# Altium project Pet_Feeder_Board.PrjPcb (part 1 of 3)
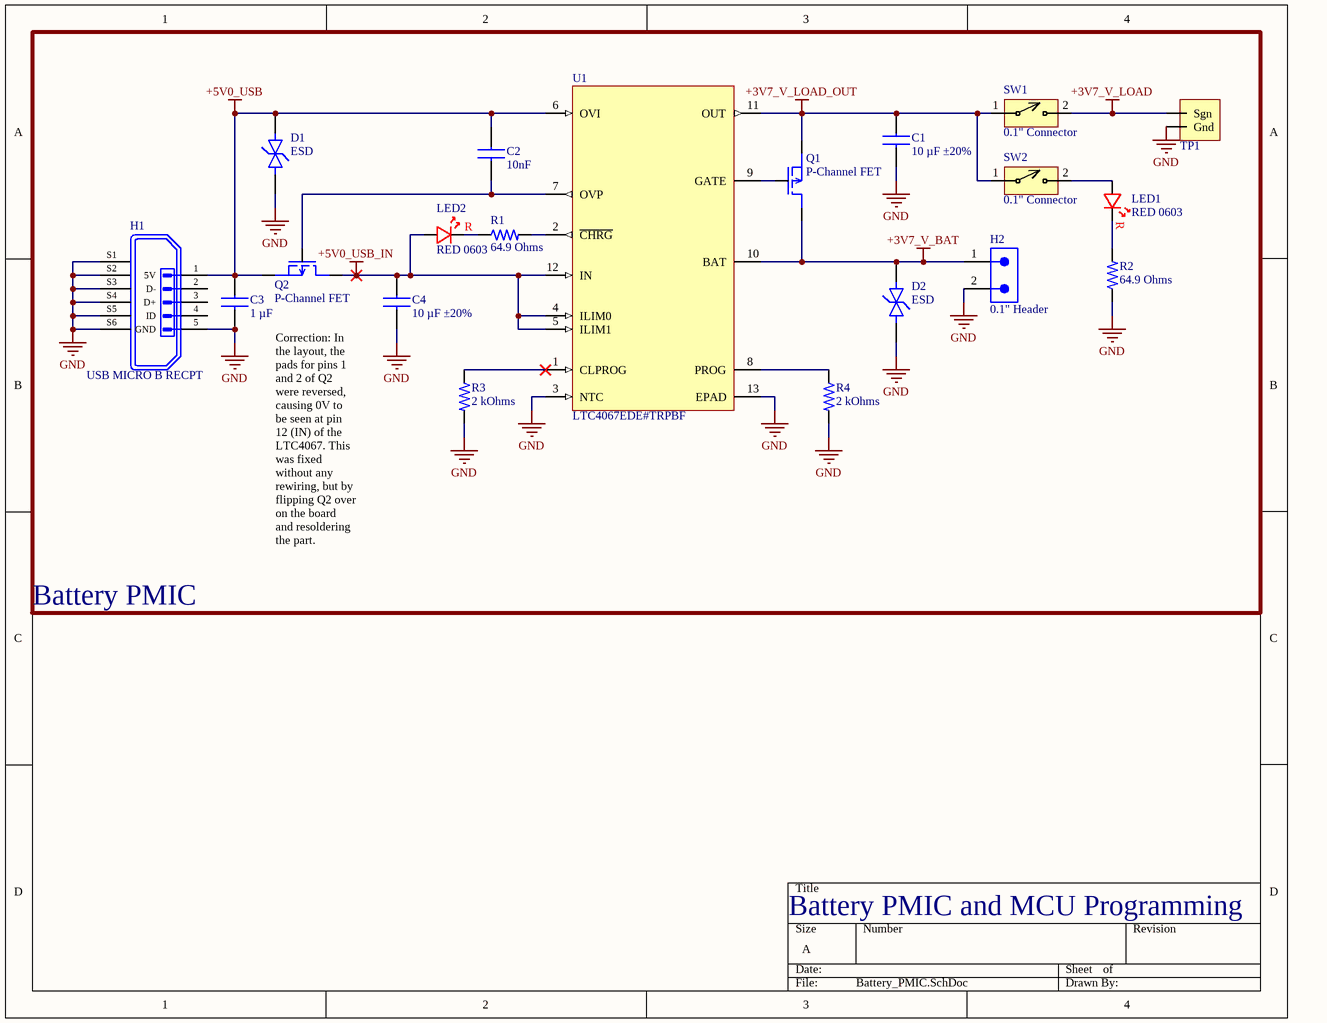
[diagram p0: Battery_PMIC.SchDoc]
6 sheets, 99 parts. Net scope: flat (ports and power ports of the same name join across sheets).
Board file: Pet_Feeder_PCB.PcbDoc
Sheets:
  Battery_PMIC.SchDoc
  Power_Circuit_Schematic.SchDoc
  BG_PWR_Radio_Schematic.SchDoc
  Peripheral_Schematic.SchDoc
  BG_IO_Programming_Schematic.SchDoc
  Notes.SchDoc

## Sheet Battery_PMIC.SchDoc
size A; SheetNumber: 1; SheetTotal: 6

### Parts
C1  10 µF ±20%  [CAPC0603X10N-M]
C2  10nF  [CAPC0603X09N]
C3  1 µF  [CAPC0603X10N]
C4  10 µF ±20%  [CAPC0603X10N-M]
D1  ESD  [DFN65P100X26-2N]
D2  ESD  [DFN65P100X26-2N]
H1  USB MICRO B RECPT  [MICROUSB_AMPHENOL_10118194-0001LF]
H2  0.1" Header  [2_PIN_100MIL]
LED1  RED 0603  [DIOC0603X06N]
LED2  RED 0603  [DIOC0603X06N]
Q1  P-Channel FET
Q2  P-Channel FET
R1  64.9 Ohms  [RESC0603X05N]
R2  64.9 Ohms  [RESC0603X05N]
R3  2 kOhms  [RESC0603X05N-1]
R4  2 kOhms  [RESC0603X05N-1]
SW1  0.1" Connector  [2Pin-Header-Conn]
SW2  0.1" Connector  [2Pin-Header-Conn]
TP1  10x Probe TP  [TP10x_Probe]  (value not drawn)  (no BOM)
U1  LTC4067EDE#TRPBF  [SON50P300X80_HS-13N]

### Blocks framed on the sheet
Battery PMIC: C1-C4 D1 D2 H1 H2 LED1 LED2 Q1 Q2 R1-R4 SW1 SW2 TP1 U1

### Nets
+3V7_V_BAT: D2.2 H2.1 Q1.1 U1.10(BAT)
+3V7_V_LOAD: SW1.2 TP1.1(Sgn)
+3V7_V_LOAD_OUT: C1.1 Q1.2 SW1.1 SW2.1 U1.11(OUT)
+5V0_USB: C2.1 C3.1 D1.2 H1.1(5V) Q2.2 U1.6(OVI)
+5V0_USB_IN: C4.1 LED2.A Q2.1 U1.4(ILIM0) U1.5(ILIM1) U1.12(IN)
GND: C1.2 C3.2 C4.2 D1.1 D2.1 H1.5(GND) H1.S1 H1.S2 H1.S3 H1.S4 H1.S5 H1.S6 H2.2 R2.1 R3.2 R4.2 TP1.2(Gnd) U1.3(NTC) U1.13(EPAD)
NetC2_2: C2.2 Q2.3 U1.7(OVP)
NetLED1_A: LED1.A SW2.2
NetLED1_C: LED1.C R2.2
NetLED2_C: LED2.C R1.1
NetQ1_3: Q1.3 U1.9(GATE)
NetR1_2: R1.2 U1.2(~{CHRG})
NetR3_1: R3.1 U1.1(CLPROG)
NetR4_1: R4.1 U1.8(PROG)

Not connected (* = marked no-connect by the designer): H1 2(D-) 3(D+) 4(ID)

### Notes on the sheet
- Correction: In the layout, the pads for pins 1 and 2 of Q2 were reversed, causing 0V to be seen at pin 12 (IN) of the LTC4067. This was fixed without any rewiring, but by flipping Q2 over on the board and resoldering the part.
- Battery PMIC and MCU Programming
- (in symbol LTST-C191KRKT) R

### Library data of the parts
C1 C4 = GRT188C81C106ME13D: 0603 10 uF 16 V ±20% Tolerance X6S Surface Mount Multilayer Ceramic Capacitor; Manufacturer: Murata; Capacitance: 10uF; Voltage Rating: 16V; Supplier 1: Digi-Key; Manufacturer Part Number: GRT188C81C106ME13D; RoHS: No; Category: Ceramic Capacitors; Stock 1: 8428; Pricing 1: 1=0.50000, 10=0.34800, 50=0.24380, 100=0.20890, 500=0.15666, 1000=0.13230 (USD); Mount: Surface Mount; Case/Package: 0603; Case Code (Metric): 1608; Case Code (Imperial): 0603; Min Operating Temperature: -55°C; Max Operating Temperature: 105°C; Packaging: Tape and Reel; Tolerance: 20%; Length: 0.063inch; Width: 0.031inch; Thickness: 0.035inch; Ratings: AEC-Q200; RoHS Compliant: No; ComponentLink1URL: http://search.murata.co.jp/Ceramy/image/img/A01X/G101/ENG/GRT188C81C106ME13-01.pdf?src-supplier=Digi-Key; ComponentLink1Description: http://search.murata.co.jp/Ceramy/image/img/A01X/G101/ENG/GRT188C81C106ME13-01.pdf?src-supplier=Digi-Key
C2 = C0603C103J4RACTU: Cap Ceramic 0.01uF 16V X7R 5% SMD 0603 125°C Paper T/R; Manufacturer: KEMET; Dissipation Factor: 3.5%; Supplier 1: Digi-Key; Manufacturer Part Number: C0603C103J4RACTU; RoHS: Yes; Category: Ceramic Capacitors; Stock 1: 5301; Pricing 1: 1=0.35000, 10=0.24300, 50=0.16200, 100=0.13760, 500=0.09716, 1000=0.08501 (USD); Mount: Surface Mount; Case/Package: 0603; Case Code (Metric): 1608; Case Code (Imperial): 0603; Dielectric Material: Ceramic; Min Operating Temperature: -55°C; Max Operating Temperature: 125°C; Tolerance: 5%; Capacitance: 10nF; Dielectric: X7R; Packaging: Tape and Reel; Voltage Rating: 16V; Package Quantity: 1; Voltage Rating (DC): 16V; Termination: SMD/SMT; Series: C; Construction: Flat; Length: 1.6mm; Width: 0.031inch; Height: 0.8mm; Thickness: 0.034inch; Lead Pitch: 0.7mm; Depth: 0.8mm; Radiation Hardening: No; REACH SVHC: No SVHC; RoHS Compliant: Yes; ComponentLink1URL: https://datasheet.ciiva.com/5417/kem-c1002-x7r-smd-5417414.pdf?src-supplier=Mouser; ComponentLink1Description: https://datasheet.ciiva.com/5417/kem-c1002-x7r-smd-5417414.pdf?src-supplier=Mouser
C3 = C0603X105J4RAC7867: Cap Ceramic 1uF 16V X7R 5% SMD 0603 125°C Paper T/R; Manufacturer: KEMET; Supplier 1: Digi-Key; Manufacturer Part Number: C0603X105J4RAC7867; RoHS: No; Category: Ceramic Capacitors; Stock 1: 20000; Pricing 1: 1=0.46000, 10=0.32200, 50=0.24340, 100=0.21210, 500=0.15708, 1000=0.13352 (USD); Mount: Surface Mount; Case/Package: 0603; Case Code (Imperial): 0603; Case Code (Metric): 1608; Min Operating Temperature: -55°C; Max Operating Temperature: 125°C; Features: Soft Termination; Packaging: Tape and Reel; Capacitance: 1uF; Tolerance: 5%; Voltage Rating: 16V; ComponentLink1URL: https://api.kemet.com/component-edge/download/datasheet/C0603X105J4RAC7867.pdf?src-supplier=Digi-Key; ComponentLink1Description: https://api.kemet.com/component-edge/download/datasheet/C0603X105J4RAC7867.pdf?src-supplier=Digi-Key
D1 D2 = ESDL4151MX4T5G: 15 V Bidirectional Low Capacitance ESD Protection Diode for High Speed Data Lines 15V; Manufacturer: ON Semiconductor; Supplier 1: Digi-Key; Manufacturer Part Number: ESDL4151MX4T5G; RoHS: Yes; Category: ESD and Circuit Protection ICs; Stock 1: 6875; Pricing 1: 1=0.49000, 10=0.36900, 100=0.23000, 500=0.15736, 1000=0.12105, 2000=0.10895 (USD); RoHS Compliant: Yes
H1 = 10118194-0001LF: USB - micro B USB 2.0 Receptacle Connector 5 Position Surface Mount, Right Angle; Through Hole; Manufacturer: Amphenol FCI; Number of Terminals/Pins: 5; Current Rating: 1.8A; Connector Type: USB,Receptacle; Insulation Resistance: 1GR; Number of Ports: 1; Max Voltage Rating (AC): 100V; Pitch: 0.65mm; Supplier 1: Digi-Key; Manufacturer Part Number: 10118194-0001LF; RoHS: Yes; Category: USB Connectors; Stock 1: 87961; Pricing 1: 1=0.48000, 10=0.45100, 25=0.38680, 50=0.32860, 100=0.31580, 250=0.28360, 500=0.27070 (USD); Mount: Surface Mount,Horizontal; Contact Material: Copper Alloy; Contact Plating: Gold; Housing Material: Polymer; Color: Black; Min Operating Temperature: -55°C; Max Operating Temperature: 85°C; Package Quantity: 9600; Packaging: Tape and Reel; Gender: Receptacle; Number of Contacts: 5; Termination: Solder; Orientation: Right Angle; Features: Shielded; Length: 8.05mm; Depth: 5mm; Radiation Hardening: No; Lead Free: Lead Free; Flammability Rating: UL94 V-0; ComponentLink1URL: https://datasheet.ciiva.com/4598/10118194ac-197217-4598807.pdf?src-supplier=Mouser; ComponentLink1Description: https://datasheet.ciiva.com/4598/10118194ac-197217-4598807.pdf?src-supplier=Mouser; ComponentLink2URL: https://datasheet.ciiva.com/26945/getdatasheetpartid-418619-26945695.pdf?src-supplier=Verical; ComponentLink2Description: https://datasheet.ciiva.com/26945/getdatasheetpartid-418619-26945695.pdf?src-supplier=Verical; ComponentLink3URL: https://datasheet.ciiva.com/851/10118194-851110.pdf?src-supplier=Digi-Key; ComponentLink3Description: https://datasheet.ciiva.com/851/10118194-851110.pdf?src-supplier=Digi-Key; ComponentLink4URL: https://datasheet.ciiva.com/851/10118194-851111.pdf?src-supplier=Digi-Key; ComponentLink4Description: https://datasheet.ciiva.com/851/10118194-851111.pdf?src-supplier=Digi-Key; Supplier Part Number 1: 609-4618-6-ND
H2 = PBC01DAAN: CONN HEADER .100 DUAL STR 2POS; Manufacturer: Sullins; Number of Positions: 2; Gender: Male; Connector Type: Male Pin; Row Spacing: 0.1inch; Supplier 1: Digi-Key; Manufacturer Part Number: PBC01DAAN; RoHS: Yes; Category: Connectors; Stock 1: 12443; Pricing 1: 1=0.20000, 10=0.18500, 25=0.15800, 50=0.13820, 100=0.12830, 250=0.11344, 500=0.10852 (USD); Mount: Through Hole; Color: Black; Contact Plating: Gold; Housing Color: Black; Contact Material: Bronze; Housing Material: Plastic; Packaging: Bulk; Number of Rows: 2; Package Quantity: 1; Termination: Solder; Number of Contacts: 2; Contact Type: Male Pin; Length: 2.54mm; Width: 5.08mm; Height: 2.54mm; Contact Mating Length: 0.23inch; Pitch: 0.1inch; Lead Free: Lead Free; RoHS Compliant: Yes; ComponentLink1URL: http://www.sullinscorp.com/catalogs/77_PAGE108-109_.100_MALE_HDR.pdf?src-supplier=Digi-Key; ComponentLink1Description: http://www.sullinscorp.com/catalogs/77_PAGE108-109_.100_MALE_HDR.pdf?src-supplier=Digi-Key; ComponentLink2URL: http://www.sullinscorp.com/catalogs/97_Page78-79_HEADER_.100_2.54mm_MALE_BREAKAWAY.pdf?src-supplier=Future+Electronics; ComponentLink2Description: http://www.sullinscorp.com/catalogs/97_Page78-79_HEADER_.100_2.54mm_MALE_BREAKAWAY.pdf?src-supplier=Future+Electronics
LED1 LED2 = LTST-C191KRKT: 0603(H=0.65mm) 红色 λD=631nm VR=5V VF=2.0V~2.4V IF=20mA PD=75mW; Manufacturer: Vishay Lite-On; Lens Color: Colorless; Power Rating: 75mW; Luminous Intensity: 54mcd; Viewing Angle: 130°; Forward Voltage: 2V; Lens Style: Clear,Diffused,Colorless,Rectangular; Forward Current: 30mA; Dominant Wavelength: 631nm; Test Current: 20mA; Lens Transparency: Clear; Number of Elements: 1; Wavelength: 639nm; Reverse Voltage: 5V; Supplier 1: Digi-Key; Manufacturer Part Number: LTST-C191KRKT; RoHS: Yes; Category: LEDs; Stock 1: 9; Pricing 1: 1=0.26000, 10=0.14100, 100=0.06560, 500=0.06060, 1000=0.04747, 2000=0.04646 (USD); Mount: Surface Mount; Case/Package: 0603; Number of Pins: 2; Color: Red; Case Code (Metric): 1608; Case Code (Imperial): 0603; Min Operating Temperature: -55°C; Max Operating Temperature: 85°C; Packaging: Tape and Reel; Package Quantity: 1; Illumination Color: Red; Power Dissipation: 75mW; Number of LEDs: 1; Voltage: 2V; Length: 1.6mm; Width: 0.8mm; Height: 0.55mm; Depth: 0.8mm; Radiation Hardening: No; Lead Free: Lead Free; RoHS Compliant: Yes; ComponentLink1URL: https://datasheet.ciiva.com/11773/0900766b80dc02b2-11773601.pdf?src-supplier=RSComponents; ComponentLink1Description: https://datasheet.ciiva.com/11773/0900766b80dc02b2-11773601.pdf?src-supplier=RSComponents; ComponentLink2URL: https://datasheet.ciiva.com/12400/lite-on-ltst-c191krkt-190135-12400910.pdf?src-supplier=Mouser; ComponentLink2Description: https://datasheet.ciiva.com/12400/lite-on-ltst-c191krkt-190135-12400910.pdf?src-supplier=Mouser; ComponentLink3URL: https://datasheet.ciiva.com/16212/ltst-c191krkt-16212419.pdf?src-supplier=Future+Electronics; ComponentLink3Description: https://datasheet.ciiva.com/16212/ltst-c191krkt-16212419.pdf?src-supplier=Future+Electronics; ComponentLink4URL: https://datasheet.ciiva.com/15117/getdatasheetpartid-141922-15117737.pdf?src-supplier=Verical; ComponentLink4Description: https://datasheet.ciiva.com/15117/getdatasheetpartid-141922-15117737.pdf?src-supplier=Verical; ComponentLink5URL: https://datasheet.ciiva.com/2109/s-110-ltst-c191krkt-2109971.pdf?src-supplier=Digi-Key; ComponentLink5Description: https://datasheet.ciiva.com/2109/s-110-ltst-c191krkt-2109971.pdf?src-supplier=Digi-Key; ComponentLink6URL: https://datasheet.ciiva.com/2109/s-110-ltst-c191krkt-2109970.pdf?src-supplier=Digi-Key; ComponentLink6Description: https://datasheet.ciiva.com/2109/s-110-ltst-c191krkt-2109970.pdf?src-supplier=Digi-Key; ComponentLink7URL: https://datasheet.ciiva.com/2109/s-110-ltst-c191krkt-2109972.pdf?src-supplier=Digi-Key; ComponentLink7Description: https://datasheet.ciiva.com/2109/s-110-ltst-c191krkt-2109972.pdf?src-supplier=Digi-Key
Q1 Q2 = AO3419: Trans MOSFET P-CH 20V 3.5A 3-Pin SOT-23; Manufacturer: Alpha & Omega Semiconductor; Rds On Max: 85mR; Input Capacitance: 400pF; Max Power Dissipation: 1.4W; Number of Elements: 1; Supplier 1: Digi-Key; Manufacturer Part Number: AO3419; RoHS: Yes; Category: MOSFETs; Pricing 1: 1=0.43000, 10=0.32200, 100=0.20060, 500=0.13728, 1000=0.10560 (USD); Mount: Surface Mount; Case/Package: TO-236-3; Number of Pins: 3; Min Operating Temperature: -55°C; Max Operating Temperature: 150°C; Packaging: Tape and Reel; Drain to Source Voltage (Vdss): 20V; Continuous Drain Current (ID): 3.5A; Power Dissipation: 1.4W; Series: -; Radiation Hardening: No; Lead Free: Lead Free; RoHS Compliant: Yes; ComponentLink1URL: https://datasheet.ciiva.com/940/ao3419-940694.pdf?src-supplier=Digi-Key; ComponentLink1Description: https://datasheet.ciiva.com/940/ao3419-940694.pdf?src-supplier=Digi-Key; ComponentLink2URL: https://datasheet.ciiva.com/940/ao3419-940695.pdf?src-supplier=Digi-Key; ComponentLink2Description: https://datasheet.ciiva.com/940/ao3419-940695.pdf?src-supplier=Digi-Key; ComponentLink3URL: https://datasheet.ciiva.com/940/ao3419-940696.pdf?src-supplier=Digi-Key; ComponentLink3Description: https://datasheet.ciiva.com/940/ao3419-940696.pdf?src-supplier=Digi-Key
R1 R2 = CRCW060364R9FKEA: Res Thick Film 0603 64.9 Ohm 1% 1/10W ±100ppm/°C Molded SMD SMD Paper T/R; Manufacturer: Vishay; Resistance: 64.9R; Power Rating: 100mW; Voltage Rating: 75V; Supplier 1: Digi-Key; Manufacturer Part Number: CRCW060364R9FKEA; RoHS: Yes; Category: Chip SMD Resistors; Stock 1: 23690; Pricing 1: 1=0.10000, 10=0.03800, 100=0.01560, 1000=0.00701, 2500=0.00608 (USD); Case/Package: 0603; Number of Pins: 2; Case Code (Metric): 1608; Case Code (Imperial): 0603; Contact Plating: Tin; Weight: 7.1E-05oz; Min Operating Temperature: -55°C; Max Operating Temperature: 155°C; Package Quantity: 10; Tolerance: 1%; Packaging: Tape and Reel; Resistor Type: Thick Film; Number of Terminations: 2; Max Power Dissipation: 100mW; Temperature Coefficient: 100ppm/°C; Features: Automotive AEC-Q200; Series: CRCW; Termination: SMD/SMT; Voltage Rating (DC): 75V; Resistance Tolerance: 1%; Construction: Rectangular; Length: 1.55mm; Width: 0.033inch; Height: 0.02inch; Depth: 0.85mm; Radiation Hardening: No; RoHS Compliant: Yes; REACH SVHC: Unknown; Military Standard: Not; Lead Free: Lead Free; ComponentLink1URL: https://datasheet.ciiva.com/2525/dcrcwe3-2525455.pdf?src-supplier=Digi-Key; ComponentLink1Description: https://datasheet.ciiva.com/2525/dcrcwe3-2525455.pdf?src-supplier=Digi-Key; ComponentLink2URL: https://datasheet.ciiva.com/2525/dcrcwe3-2525457.pdf?src-supplier=Digi-Key; ComponentLink2Description: https://datasheet.ciiva.com/2525/dcrcwe3-2525457.pdf?src-supplier=Digi-Key; ComponentLink3URL: https://datasheet.ciiva.com/3257/dcrcwe3-3257816.pdf?src-supplier=Avnet; ComponentLink3Description: https://datasheet.ciiva.com/3257/dcrcwe3-3257816.pdf?src-supplier=Avnet; ComponentLink4URL: https://datasheet.ciiva.com/2525/dcrcwe3-2525456.pdf?src-supplier=Digi-Key; ComponentLink4Description: https://datasheet.ciiva.com/2525/dcrcwe3-2525456.pdf?src-supplier=Digi-Key; ComponentLink5URL: https://datasheet.ciiva.com/5541/dcrcwe3-109170-5541133.pdf?src-supplier=Mouser; ComponentLink5Description: https://datasheet.ciiva.com/5541/dcrcwe3-109170-5541133.pdf?src-supplier=Mouser; ComponentLink6URL: https://datasheet.ciiva.com/7823/1697337-7823000.pdf?src-supplier=Element14; ComponentLink6Description: https://datasheet.ciiva.com/7823/1697337-7823000.pdf?src-supplier=Element14; ComponentLink7URL: https://datasheet.ciiva.com/7823/1697337-7823001.pdf?src-supplier=Element14; ComponentLink7Description: https://datasheet.ciiva.com/7823/1697337-7823001.pdf?src-supplier=Element14; ComponentLink8URL: https://datasheet.ciiva.com/22674/1847332-22674604.pdf?src-supplier=Element14; ComponentLink8Description: https://datasheet.ciiva.com/22674/1847332-22674604.pdf?src-supplier=Element14; ComponentLink9URL: https://datasheet.ciiva.com/16204/dcrcwe3-16204218.pdf?src-supplier=Future+Electronics; ComponentLink9Description: https://datasheet.ciiva.com/16204/dcrcwe3-16204218.pdf?src-supplier=Future+Electronics; ComponentLink10URL: https://datasheet.ciiva.com/22705/1697337-22705559.pdf?src-supplier=Element14; ComponentLink10Description: https://datasheet.ciiva.com/22705/1697337-22705559.pdf?src-supplier=Element14
R3 R4 = CRCW06032K00FKTA: Res Thick Film 0603 2K Ohm 1% 1/10W ±100ppm/°C Molded SMD SMD Paper T/R; Manufacturer: Vishay Dale; Resistance: 2kR; Power Rating: 100mW; Voltage Rating: 75V; Supplier 1: Digi-Key; Manufacturer Part Number: CRCW06032K00FKTA; RoHS: No; Category: Chip SMD Resistors; Stock 1: 4209; Pricing 1: 1=0.16000, 10=0.13900, 100=0.05350, 1000=0.02353, 2500=0.02032 (USD); Mount: Surface Mount; Case/Package: 0603; Number of Pins: 2; Weight: 7.1E-05oz; Case Code (Imperial): 0603; Case Code (Metric): 1608; Contact Plating: Tin,Lead; Min Operating Temperature: -55°C; Max Operating Temperature: 155°C; Tolerance: 1%; Packaging: Tape and Reel; Package Quantity: 5000; Resistor Type: Thick Film; Number of Terminations: 2; Termination: SMD/SMT; Temperature Coefficient: 100ppm/°C; Max Power Dissipation: 100mW; Power Dissipation: 100mW; Voltage Rating (DC): 75V; Features: Automotive AEC-Q200; Series: CRCW; Construction: Rectangular; Resistance Tolerance: 1%; Length: 1.55mm; Width: 0.033inch; Height: 0.02inch; Depth: 0.85mm; Radiation Hardening: No; Lead Free: Contains Lead; RoHS Compliant: No; REACH SVHC: Unknown; Military Standard: Not; ComponentLink1URL: https://datasheet.ciiva.com/15159/getdatasheetpartid-28881-15159221.pdf?src-supplier=Verical; ComponentLink1Description: https://datasheet.ciiva.com/15159/getdatasheetpartid-28881-15159221.pdf?src-supplier=Verical; ComponentLink2URL: https://datasheet.ciiva.com/9093/dcrcw-9093590.pdf?src-supplier=Avnet; ComponentLink2Description: https://datasheet.ciiva.com/9093/dcrcw-9093590.pdf?src-supplier=Avnet; ComponentLink3URL: https://datasheet.ciiva.com/2565/dcrcw-2565199.pdf?src-supplier=Digi-Key; ComponentLink3Description: https://datasheet.ciiva.com/2565/dcrcw-2565199.pdf?src-supplier=Digi-Key; ComponentLink4URL: https://datasheet.ciiva.com/9094/dcrcw-9094813.pdf?src-supplier=Avnet; ComponentLink4Description: https://datasheet.ciiva.com/9094/dcrcw-9094813.pdf?src-supplier=Avnet
SW1 SW2 = PRPC001DAAN-RC: PBT/Brass 2 Position 2.54 mm Pitch Straight Male Breakaway Header; Manufacturer: Sullins; Number of Positions: 2; Connector Type: Male Pin; Row Spacing: 0.1inch; Supplier 1: Digi-Key; Manufacturer Part Number: PRPC001DAAN-RC; RoHS: Yes; Category: Connectors; Stock 1: 15318; Pricing 1: 1=0.08000, 10=0.07300, 25=0.05400, 50=0.04640, 100=0.04490, 250=0.03872, 500=0.03716 (USD); Mount: Through Hole; Color: Black; Contact Plating: Gold; Package Quantity: 1; Number of Rows: 2; Packaging: Bulk; Termination: Solder; Series: -; Contact Type: Male Pin; Contact Mating Length: 0.23inch; ComponentLink1URL: https://datasheet.ciiva.com/741/xrxczzzdxxn-rc-11636-b-741284.pdf?src-supplier=Digi-Key; ComponentLink1Description: https://datasheet.ciiva.com/741/xrxczzzdxxn-rc-11636-b-741284.pdf?src-supplier=Digi-Key
TP1 = TP_10x_Probe: Test Point 300 mil centers
U1 = LTC4067EDE#TRPBF: IC USB POWER MANAGER 12-DFN; Manufacturer: Analog Devices / Linear Technology; Number of Outputs: 1; Supplier 1: Digi-Key; Manufacturer Part Number: LTC4067EDE#TRPBF; RoHS: Yes; Category: Battery Management; Stock 1: 1489; Pricing 1: 1=5.17000, 10=4.64200, 25=4.38840, 100=3.80330, 250=3.60824, 500=3.23766, 1000=3.03600 (USD); Case/Package: DFN; Number of Pins: 12; Min Operating Temperature: -40°C; Max Operating Temperature: 85°C; Package Quantity: 2500; Packaging: Tape and Reel; Number of Cells: 1; Series: -; Length: 4mm; RoHS Compliant: Yes; ComponentLink1URL: https://datasheet.ciiva.com/1933/25032-1933748.pdf?src-supplier=Digi-Key; ComponentLink1Description: https://datasheet.ciiva.com/1933/25032-1933748.pdf?src-supplier=Digi-Key

## Sheet Power_Circuit_Schematic.SchDoc
size A; SheetNumber: 2; SheetTotal: 6
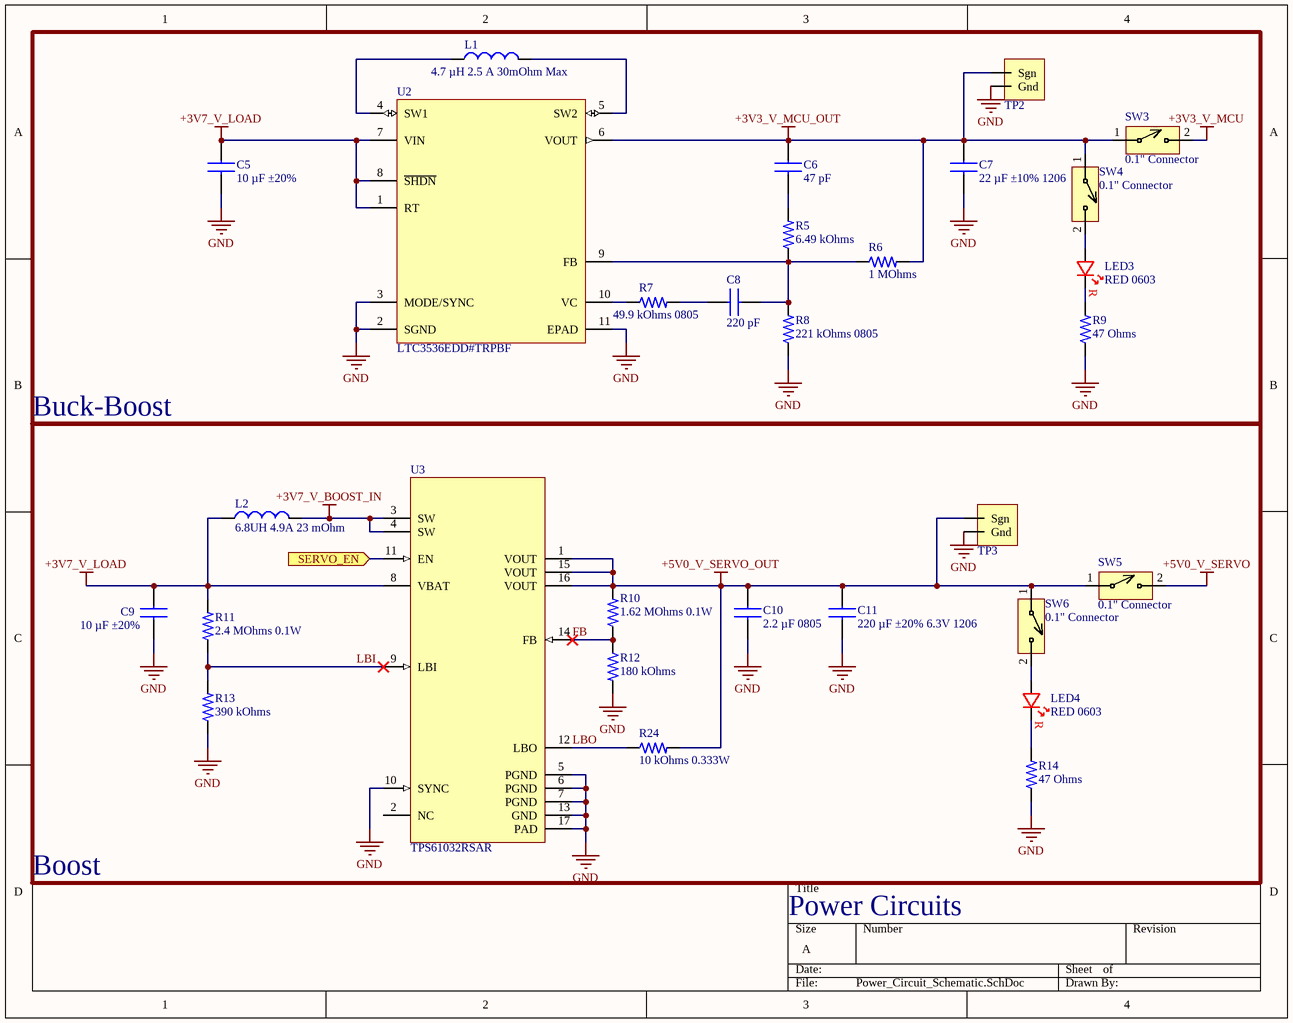
[diagram p1: Power_Circuit_Schematic.SchDoc]

### Parts
C5  10 µF ±20%  [CAPC0603X10N-M]
C6  47 pF  [CAPC0603X09N]
C7  22 µF ±10% 1206  [CAPC1206X18N]
C8  220 pF  [CAPC0603X09N]
C9  10 µF ±20%  [CAPC0603X10N-M]
C10  2.2 µF 0805  [CAPC0805X12N]
C11  220 µF ±20% 6.3V 1206  [CAPC1206X19N]
L1  4.7 µH 2.5 A 30mOhm Max  [INDP7272X45N]
L2  6.8UH 4.9A 23 mOhm  [INDP120120X45N]
LED3  RED 0603  [DIOC0603X06N]
LED4  RED 0603  [DIOC0603X06N]
R5  6.49 kOhms  [RESC0603X05N]
R6  1 MOhms  [RESC0603X06N-BB]
R7  49.9 kOhms 0805  [RESC0805X05N]
R8  221 kOhms 0805  [RESC0805X06N]
R9  47 Ohms  [RESC0603X06N]
R10  1.62 MOhms 0.1W  [RESC0603X05N-2]
R11  2.4 MOhms 0.1W  [RESC0603X05N-2]
R12  180 kOhms  [RESC0603X05N]
R13  390 kOhms  [RESC0603X05N]
R14  47 Ohms  [RESC0603X06N]
R24  10 kOhms 0.333W  [RESC0603X06N]
SW3  0.1" Connector  [2Pin-Header-Conn]
SW4  0.1" Connector  [2Pin-Header-Conn]
SW5  0.1" Connector  [2Pin-Header-Conn]
SW6  0.1" Connector  [2Pin-Header-Conn]
TP2  10x Probe TP  [TP10x_Probe]  (value not drawn)  (no BOM)
TP3  10x Probe TP  [TP10x_Probe]  (value not drawn)  (no BOM)
U2  LTC3536EDD#TRPBF  [SON50P300X80_HS-11N]
U3  TPS61032RSAR  [QFN65P400X400X100_HS-17N]

### Blocks framed on the sheet
Buck-Boost: C5-C8 L1 LED3 R5-R9 SW3 SW4 TP2 U2
Boost: C9-C11 L2 LED4 R10-R14 R24 SW5 SW6 TP3 U3

### Ports
SERVO_EN (in)

### Nets
+3V3_V_MCU: SW3.2
+3V3_V_MCU_OUT: C6.1 C7.1 R6.2 SW3.1 SW4.1 TP2.1(Sgn) U2.6(VOUT)
+3V7_V_BOOST_IN: L2.2 U3.3(SW) U3.4(SW)
+3V7_V_LOAD: C5.1 C9.1 L2.1 R11.2 U2.1(RT) U2.7(VIN) U2.8(~{SHDN}) U3.8(VBAT)
+5V0_V_SERVO: SW5.2
+5V0_V_SERVO_OUT: C10.1 C11.1 R10.2 R24.2 SW5.1 SW6.1 TP3.1(Sgn) U3.1(VOUT) U3.15(VOUT) U3.16(VOUT)
GND: C5.2 C7.2 C9.2 C10.2 C11.2 R8.1 R9.1 R12.2 R13.1 R14.1 TP2.2(Gnd) TP3.2(Gnd) U2.2(SGND) U2.3(MODE/SYNC) U2.11(EPAD) U3.5(PGND) U3.6(PGND) U3.7(PGND) U3.10(SYNC) U3.13(GND) U3.17(PAD)
FB: R10.1 R12.1 U3.14(FB)
LBI: R11.1 R13.2 U3.9(LBI)
LBO: R24.1 U3.12(LBO)
SERVO_EN: U3.11(EN) ; port SERVO_EN
NetC6_2: C6.2 R5.2
NetC8_1: C8.1 R5.1 R6.1 R8.2 U2.9(FB)
NetC8_2: C8.2 R7.2
NetL1_1: L1.1 U2.4(SW1)
NetL1_2: L1.2 U2.5(SW2)
NetLED3_A: LED3.A SW4.2
NetLED3_C: LED3.C R9.2
NetLED4_A: LED4.A SW6.2
NetLED4_C: LED4.C R14.2
NetR7_1: R7.1 U2.10(VC)

Not connected (* = marked no-connect by the designer): U3 2(NC)

### Notes on the sheet
- Power Circuits
- (in symbol LTST-C191KRKT) R

### Library data of the parts
C5 C9 = GRT188C81C106ME13D: as C1 on sheet Battery_PMIC; Supplier 1: Digi-Key; Manufacturer Part Number: GRT188C81C106ME13D; RoHS: No; Category: Ceramic Capacitors; Stock 1: 8428; Pricing 1: 1=0.50000, 10=0.34800, 50=0.24380, 100=0.20890, 500=0.15666, 1000=0.13230 (USD); Mount: Surface Mount; Case/Package: 0603; Case Code (Metric): 1608; Case Code (Imperial): 0603; Min Operating Temperature: -55°C; Max Operating Temperature: 105°C; Packaging: Tape and Reel; Tolerance: 20%; Length: 0.063inch; Width: 0.031inch; Thickness: 0.035inch; Ratings: AEC-Q200; RoHS Compliant: No; ComponentLink1URL: http://search.murata.co.jp/Ceramy/image/img/A01X/G101/ENG/GRT188C81C106ME13-01.pdf?src-supplier=Digi-Key; ComponentLink1Description: http://search.murata.co.jp/Ceramy/image/img/A01X/G101/ENG/GRT188C81C106ME13-01.pdf?src-supplier=Digi-Key
C6 = C0603C470J4GAC7867: Cap Ceramic 47pF 16V C0G 5% SMD 0603 125°C Paper T/R; Manufacturer: KEMET; Supplier 1: Digi-Key; Manufacturer Part Number: C0603C470J4GAC7867; RoHS: Yes; Category: Ceramic Capacitors; Stock 1: 19436; Pricing 1: 1=0.25000, 10=0.17400, 50=0.11580, 100=0.09840, 500=0.06944, 1000=0.06075 (USD); Mount: Surface Mount; Case/Package: 0603; Dielectric Material: Ceramic; Case Code (Imperial): 0603; Case Code (Metric): 1608; Min Operating Temperature: -55°C; Max Operating Temperature: 125°C; Packaging: Tape and Reel; Capacitance: 47pF; Tolerance: 5%; Dielectric: C0G; Voltage Rating (DC): 16V; Series: SMD Comm C0G; Voltage Rating: 16V; Construction: Flat; Length: 1.6mm; Height: 0.8mm; Depth: 0.8mm; Radiation Hardening: No; Lead Free: Lead Free; RoHS Compliant: Yes; ComponentLink1URL: http://components.arrow.com/part/dataview/0323_00323118?src-supplier=Arrow+Europe; ComponentLink1Description: http://components.arrow.com/part/dataview/0323_00323118?src-supplier=Arrow+Europe; ComponentLink2URL: http://capacitoredge.kemet.com/capedge2/DataSheet?pn=C0603C470J4GAC7867&src-supplier=Avnet+Europe; ComponentLink2Description: http://capacitoredge.kemet.com/capedge2/DataSheet?pn=C0603C470J4GAC7867&src-supplier=Avnet+Europe; ComponentLink3URL: https://api.kemet.com/component-edge/download/datasheet/C0603C470J4GACTU.pdf?src-supplier=Digi-Key; ComponentLink3Description: https://api.kemet.com/component-edge/download/datasheet/C0603C470J4GACTU.pdf?src-supplier=Digi-Key; ComponentLink4URL: http://capacitoredge.kemet.com/capedge2/DataSheet?pn=C0603C470J4GAC7867&src-supplier=Avnet; ComponentLink4Description: http://capacitoredge.kemet.com/capedge2/DataSheet?pn=C0603C470J4GAC7867&src-supplier=Avnet
C7 = GRT31CC81C226KE01L: 1206 22 uF 16 V ±10% Tolerance X6S Multilayer Ceramic Capacitor; Manufacturer: Murata; Capacitance: 22uF; Voltage Rating: 16V; Supplier 1: Digi-Key; Manufacturer Part Number: GRT31CC81C226KE01L; RoHS: Yes; Category: Ceramic Capacitors; Stock 1: 62743; Pricing 1: 1=0.56000, 10=0.39500, 50=0.29880, 100=0.26020, 500=0.19272, 1000=0.16381 (USD); Mount: Surface Mount; Case/Package: 1206; Case Code (Metric): 3216; Case Code (Imperial): 1206; Min Operating Temperature: -55°C; Max Operating Temperature: 105°C; Packaging: Tape and Reel; Tolerance: 10%; Length: 0.126inch; Width: 0.063inch; Thickness: 0.071inch; Ratings: AEC-Q200; RoHS Compliant: Yes; ComponentLink1URL: http://search.murata.co.jp/Ceramy/image/img/A01X/G101/ENG/GRT31CC81C226KE01-01.pdf?src-supplier=Digi-Key; ComponentLink1Description: http://search.murata.co.jp/Ceramy/image/img/A01X/G101/ENG/GRT31CC81C226KE01-01.pdf?src-supplier=Digi-Key
C8 = C0603C221J4GAC7867: Cap Cer 220PF 16V C0G/NP0 0603; Manufacturer: KEMET; Dielectric Material: Ceramic; Tolerance: 5%; Dielectric: C0G; Supplier 1: DigiKey; Manufacturer Part Number: C0603C221J4GAC7867; Category: Ceramic Capacitors; Stock 1: 3450; Pricing 1: 1=0.30000, 10=0.20700, 50=0.13780, 100=0.11710, 500=0.08264, 1000=0.07230 (USD); Mount: Surface Mount; Case/Package: 0603; Min Operating Temperature: -55°C; Max Operating Temperature: 125°C; Capacitance: 220pF; Packaging: Tape and Reel; Voltage Rating (DC): 16V; Construction: Flat; Length: 1.6mm; Height: 0.8mm; Depth: 0.8mm; Radiation Hardening: No; Lead Free: Lead Free; ComponentLink1URL: http://components.arrow.com/part/dataview/0323_00318431?src-supplier=Arrow+Europe; ComponentLink1Description: http://components.arrow.com/part/dataview/0323_00318431?src-supplier=Arrow+Europe; ComponentLink2URL: http://capacitoredge.kemet.com/capedge2/DataSheet?pn=C0603C221J4GAC7867&src-supplier=Avnet; ComponentLink2Description: http://capacitoredge.kemet.com/capedge2/DataSheet?pn=C0603C221J4GAC7867&src-supplier=Avnet; ComponentLink3URL: http://capacitoredge.kemet.com/capedge2/DataSheet?pn=C0603C221J4GAC7867&src-supplier=Avnet+Europe; ComponentLink3Description: http://capacitoredge.kemet.com/capedge2/DataSheet?pn=C0603C221J4GAC7867&src-supplier=Avnet+Europe; ComponentLink4URL: https://datasheet.octopart.com/C0603C221J4GAC7867-KEMET-datasheet-157246123.pdf?src-supplier=Electro+Sonic; ComponentLink4Description: https://datasheet.octopart.com/C0603C221J4GAC7867-KEMET-datasheet-157246123.pdf?src-supplier=Electro+Sonic; ComponentLink5URL: https://datasheet.octopart.com/C0603C221J4GAC7867-KEMET-datasheet-84169754.pdf; ComponentLink5Description: https://datasheet.octopart.com/C0603C221J4GAC7867-KEMET-datasheet-84169754.pdf
C10 = C0805X225J4RECAUTO: Cap Cer 0805 2.2UF 16V X7R 5%; Manufacturer: KEMET; Supplier 1: Digi-Key; Manufacturer Part Number: C0805X225J4RECAUTO; RoHS: Yes; Category: Ceramic Capacitors; Stock 1: 1112; Pricing 1: 1=0.64000, 10=0.45000, 50=0.34040, 100=0.29640, 500=0.21956, 1000=0.18663 (USD); RoHS Compliant: Yes; ComponentLink1URL: https://api.kemet.com/component-edge/download/datasheet/C0805X225J4RECAUTO.pdf?src-supplier=Digi-Key; ComponentLink1Description: https://api.kemet.com/component-edge/download/datasheet/C0805X225J4RECAUTO.pdf?src-supplier=Digi-Key
C11 = GRM31CR60J227ME11L: 1206 220 uF 6.3 V ±20% Tolernace X5R Multilayer Ceramic Capacitor; Manufacturer: Murata; Capacitance: 220uF; Supplier 1: Digi-Key; Manufacturer Part Number: GRM31CR60J227ME11L; RoHS: Yes; Category: Ceramic Capacitors; Stock 1: 229285; Pricing 1: 1=1.25000, 10=0.99000, 50=0.85820, 100=0.74260, 500=0.56112, 1000=0.49510 (USD); Mount: Surface Mount; Case/Package: 1206; Case Code (Metric): 3216; Case Code (Imperial): 1206; Min Operating Temperature: -55°C; Max Operating Temperature: 85°C; Packaging: Cut Tape; Voltage Rating: 6.3V; Dielectric: X5R; Tolerance: 20%; Voltage Rating (DC): 6.3V; Length: 0.126inch; Width: 0.063inch; Thickness: 0.075inch; REACH SVHC: No SVHC; RoHS Compliant: Yes; ComponentLink1URL: http://www.farnell.com/datasheets/2867879.pdf?src-supplier=Farnell; ComponentLink1Description: http://www.farnell.com/datasheets/2867879.pdf?src-supplier=Farnell; ComponentLink2URL: http://www.farnell.com/datasheets/2867879.pdf?src-supplier=Element14; ComponentLink2Description: http://www.farnell.com/datasheets/2867879.pdf?src-supplier=Element14; ComponentLink3URL: http://search.murata.co.jp/Ceramy/image/img/A01X/G101/ENG/GRM31CR60J227ME11-01.pdf?src-supplier=Digi-Key; ComponentLink3Description: http://search.murata.co.jp/Ceramy/image/img/A01X/G101/ENG/GRM31CR60J227ME11-01.pdf?src-supplier=Digi-Key; ComponentLink4URL: http://search.murata.co.jp/Ceramy/image/img/A01X/partnumbering_e_01.pdf?src-supplier=Digi-Key; ComponentLink4Description: http://search.murata.co.jp/Ceramy/image/img/A01X/partnumbering_e_01.pdf?src-supplier=Digi-Key; ComponentLink5URL: http://www.farnell.com/datasheets/1957826.pdf?src-supplier=Newark; ComponentLink5Description: http://www.farnell.com/datasheets/1957826.pdf?src-supplier=Newark
L1 = B82472G6472M000: Ind Power Shielded 4.7uH 20% 100KHz Ferrite 2.5A Blister T/R; Manufacturer: TDK EPCOS; Max DC Current: 2A; DC Resistance (DCR): 30mR; Supplier 1: Digi-Key; Manufacturer Part Number: B82472G6472M000; RoHS: Yes; Category: Fixed Inductors; Stock 1: 890; Pricing 1: 1=1.55000, 10=1.43500, 25=1.32480, 50=1.10420, 100=1.03790, 250=0.92748, 500=0.79496 (USD); Mount: Surface Mount; Case/Package: SMD/SMT; Number of Pins: 2; Core Material: Ferrite; Weight: 0.052911oz; Inductance Tolerance: 20%; Shielding: Shielded; Tolerance: 20%; Packaging: Tape and Reel; Package Quantity: 1000; Inductance: 4.7uH; Termination: SMD/SMT; RMS Current (Irms): 2.5A; Saturation Current: 2A; Test Frequency: 100kHz; DC Current: 2.5A; Series: B82472G6; Inductor Type: POWER; Length: 7.3mm; Width: 7.3mm; Height: 4.5mm; Depth: 7.5mm; REACH SVHC: No SVHC; Military Standard: Not; ComponentLink1URL: https://datasheet.ciiva.com/5874/78362-5874896.pdf?src-supplier=Farnell; ComponentLink1Description: https://datasheet.ciiva.com/5874/78362-5874896.pdf?src-supplier=Farnell; ComponentLink2URL: https://datasheet.ciiva.com/8003/78362-8003419.pdf?src-supplier=Element14; ComponentLink2Description: https://datasheet.ciiva.com/8003/78362-8003419.pdf?src-supplier=Element14; ComponentLink3URL: https://datasheet.ciiva.com/22700/1899161-22700808.pdf?src-supplier=Element14; ComponentLink3Description: https://datasheet.ciiva.com/22700/1899161-22700808.pdf?src-supplier=Element14
L2 = CDRH124NP-6R8MC: Inductor Power Shielded Drum Core 6.8uH 20% 100KHz Ferrite 4.9A 23mOhm DCR T/R; Manufacturer: Sumida; DC Resistance (DCR): 23mR; Supplier 1: Digi-Key; Manufacturer Part Number: CDRH124NP-6R8MC; RoHS: Yes; Category: Fixed Inductors; Mount: Surface Mount; Core Material: Ferrite; Weight: 0.08113oz; Min Operating Temperature: -40°C; Max Operating Temperature: 100°C; Package Quantity: 500; Packaging: Tape and Reel; Tolerance: 20%; Current Rating: 4.9A; Shielding: Shielded; Inductance: 6.8uH; Test Frequency: 100kHz; Max DC Current: 4.9A; Termination: SMD/SMT; Series: CDRH124; Rated Current-Max: 4.9A; Length: 12.3mm; Width: 0.472inch; Height: 4.5mm; Height - Seated (Max): 0.177inch; Depth: 12.3mm; Radiation Hardening: No; Lead Free: Lead Free; RoHS Compliant: Yes; ComponentLink1URL: http://www.sumida.com/products/pdf/CDRH124.pdf?src-supplier=Avnet; ComponentLink1Description: http://www.sumida.com/products/pdf/CDRH124.pdf?src-supplier=Avnet; ComponentLink2URL: http://products.sumida.com/products/pdf/CDRH124.pdf?src-supplier=Digi-Key; ComponentLink2Description: http://products.sumida.com/products/pdf/CDRH124.pdf?src-supplier=Digi-Key; ComponentLink3URL: http://www.sumida.com/products/pdf/CDRH124.pdf?src-supplier=Future+Electronics; ComponentLink3Description: http://www.sumida.com/products/pdf/CDRH124.pdf?src-supplier=Future+Electronics; ComponentLink4URL: https://www.sumida.com/products/pdf/CDRH124.pdf?src-supplier=Mouser; ComponentLink4Description: https://www.sumida.com/products/pdf/CDRH124.pdf?src-supplier=Mouser; ComponentLink5URL: http://www.sumida.com/products/pdf/CDRH124.pdf?src-supplier=Avnet+Asia; ComponentLink5Description: http://www.sumida.com/products/pdf/CDRH124.pdf?src-supplier=Avnet+Asia
LED3 LED4 = LTST-C191KRKT: as LED1 on sheet Battery_PMIC; Supplier 1: Digi-Key; Manufacturer Part Number: LTST-C191KRKT; RoHS: Yes; Category: LEDs; Stock 1: 9; Pricing 1: 1=0.26000, 10=0.14100, 100=0.06560, 500=0.06060, 1000=0.04747, 2000=0.04646 (USD); Mount: Surface Mount; Case/Package: 0603; Number of Pins: 2; Color: Red; Case Code (Metric): 1608; Case Code (Imperial): 0603; Min Operating Temperature: -55°C; Max Operating Temperature: 85°C; Packaging: Tape and Reel; Package Quantity: 1; Illumination Color: Red; Power Dissipation: 75mW; Number of LEDs: 1; Voltage: 2V; Length: 1.6mm; Width: 0.8mm; Height: 0.55mm; Depth: 0.8mm; Radiation Hardening: No; Lead Free: Lead Free; RoHS Compliant: Yes; ComponentLink1URL: https://datasheet.ciiva.com/11773/0900766b80dc02b2-11773601.pdf?src-supplier=RSComponents; ComponentLink1Description: https://datasheet.ciiva.com/11773/0900766b80dc02b2-11773601.pdf?src-supplier=RSComponents; ComponentLink2URL: https://datasheet.ciiva.com/12400/lite-on-ltst-c191krkt-190135-12400910.pdf?src-supplier=Mouser; ComponentLink2Description: https://datasheet.ciiva.com/12400/lite-on-ltst-c191krkt-190135-12400910.pdf?src-supplier=Mouser; ComponentLink3URL: https://datasheet.ciiva.com/16212/ltst-c191krkt-16212419.pdf?src-supplier=Future+Electronics; ComponentLink3Description: https://datasheet.ciiva.com/16212/ltst-c191krkt-16212419.pdf?src-supplier=Future+Electronics; ComponentLink4URL: https://datasheet.ciiva.com/15117/getdatasheetpartid-141922-15117737.pdf?src-supplier=Verical; ComponentLink4Description: https://datasheet.ciiva.com/15117/getdatasheetpartid-141922-15117737.pdf?src-supplier=Verical; ComponentLink5URL: https://datasheet.ciiva.com/2109/s-110-ltst-c191krkt-2109971.pdf?src-supplier=Digi-Key; ComponentLink5Description: https://datasheet.ciiva.com/2109/s-110-ltst-c191krkt-2109971.pdf?src-supplier=Digi-Key; ComponentLink6URL: https://datasheet.ciiva.com/2109/s-110-ltst-c191krkt-2109970.pdf?src-supplier=Digi-Key; ComponentLink6Description: https://datasheet.ciiva.com/2109/s-110-ltst-c191krkt-2109970.pdf?src-supplier=Digi-Key; ComponentLink7URL: https://datasheet.ciiva.com/2109/s-110-ltst-c191krkt-2109972.pdf?src-supplier=Digi-Key; ComponentLink7Description: https://datasheet.ciiva.com/2109/s-110-ltst-c191krkt-2109972.pdf?src-supplier=Digi-Key
R5 = RCS06036K49FKEA: RES SMD 6.49K OHM 1% 1/4W 0603; Manufacturer: Vishay Dale; Resistance: 6.49kR; Max Power Dissipation: 250mW; Temperature Coefficient: 100ppm/°C; Supplier 1: Digi-Key; Manufacturer Part Number: RCS06036K49FKEA; RoHS: Yes; Category: Chip SMD Resistors; Stock 1: 9540; Pricing 1: 1=0.15000, 10=0.13300, 100=0.05120, 1000=0.02252, 2500=0.01945 (USD); Case/Package: 0603; Min Operating Temperature: -55°C; Max Operating Temperature: 155°C; Package Quantity: 5000; Packaging: Tape and Reel; Resistor Type: Thick Film; Number of Terminations: 2; Tolerance: 1%; Features: Automotive AEC-Q200; Length: 0.061inch; Width: 0.033inch; Height: 0.02inch; ComponentLink1URL: http://www.vishay.com/docs/20065/rcse3.pdf?src-supplier=Digi-Key; ComponentLink1Description: http://www.vishay.com/docs/20065/rcse3.pdf?src-supplier=Digi-Key
R6 = CMP0603-FX-1004ELF: Resistor, ResHighPower 0603 1M 1% 1/4W TC100; Manufacturer: Bourns; Supplier 1: Digi-Key; Manufacturer Part Number: CMP0603-FX-1004ELF; RoHS: Yes; Category: Chip SMD Resistors; Stock 1: 4809; Pricing 1: 1=0.15000, 10=0.13200, 100=0.05060, 1000=0.02226, 2500=0.01923 (USD); RoHS Compliant: Yes
R7 = RCC080549K9FKEA: Res Thick Film 0805 49.9K Ohm 1% 0.25W(1/4W) ±100ppm/C Pad SMD Automotive T/R; Manufacturer: Vishay Dale; Supplier 1: Digi-Key; Manufacturer Part Number: RCC080549K9FKEA; RoHS: Yes; Category: Chip SMD Resistors; Stock 1: 2991; Pricing 1: 1=0.19000, 10=0.16100, 100=0.06280, 1000=0.02629, 2500=0.02410 (USD)
R8 = RK73H2ATTD2213F: Res Thick Film 0805 221K Ohm 1% 0.25W(1/4W) ±100ppm/C Pad SMD Automotive T/R; Manufacturer: KOA Speer; Resistance: 221kR; Power Rating: 125mW; Voltage Rating: 150V; Temperature Coefficient: 100ppm/°C; Supplier 1: Digi-Key; Manufacturer Part Number: RK73H2ATTD2213F; RoHS: Yes; Category: Chip SMD Resistors; Stock 1: 28340; Pricing 1: 1=0.10000, 10=0.04200, 100=0.01710, 1000=0.00768, 2500=0.00666 (USD); Case/Package: 0805; Case Code (Imperial): 0805; Case Code (Metric): 2012; Min Operating Temperature: -55°C; Max Operating Temperature: 155°C; Tolerance: 1%; Packaging: Tape and Reel; Package Quantity: 5000; Termination: SMD/SMT; Voltage Rating (DC): 150V; Series: RK73H; Length: 2mm; Width: 1.25mm; Height: 0.5mm; Lead Free: Lead Free; RoHS Compliant: Yes; ComponentLink1URL: https://datasheet.ciiva.com/3882/39733851s9852373n5146-3882825.pdf?src-supplier=Arrow+Electronics; ComponentLink1Description: https://datasheet.ciiva.com/3882/39733851s9852373n5146-3882825.pdf?src-supplier=Arrow+Electronics
R9 R14 = CRCW060347R0FKEAC: Res Thick Film 0603 47 Ohm 1% 1/10W ±100ppm/°C Molded SMD Paper T/R; Manufacturer: Vishay Semiconductors; Resistance: 47R; Power Rating: 100mW; Supplier 1: Digi-Key; Manufacturer Part Number: CRCW060347R0FKEAC; RoHS: Yes; Category: Chip SMD Resistors; Stock 1: 3057; Pricing 1: 1=0.10000, 10=0.03600, 100=0.01450, 1000=0.00652, 2500=0.00566 (USD); Mount: Surface Mount; Case/Package: Molded; Contact Plating: Tin; Min Operating Temperature: -55°C; Max Operating Temperature: 155°C; Resistor Type: Thick Film; Termination: Wraparound; Tolerance: 1%; Temperature Coefficient: 100ppm/°C; Length: 1.55mm; Lead Free: Lead Free; RoHS Compliant: Yes; ComponentLink1URL: http://www.vishay.com/docs/28773/crcwce3.pdf?src-supplier=Digi-Key; ComponentLink1Description: http://www.vishay.com/docs/28773/crcwce3.pdf?src-supplier=Digi-Key; ComponentLink2URL: http://www.vishay.com/docs/20035/dcrcwe3.pdf?src-supplier=Avnet+Asia; ComponentLink2Description: http://www.vishay.com/docs/20035/dcrcwe3.pdf?src-supplier=Avnet+Asia
R10 = RMCF0603FT1M62: Res Thick Film 0603 1.62M Ohm 1% 1/10W ±200ppm/°C Molded SMD SMD Paper T/R; Manufacturer: Stackpole Electronics; Resistance: 1.62MR; Max Power Dissipation: 100mW; Supplier 1: Digi-Key; Manufacturer Part Number: RMCF0603FT1M62; RoHS: Yes; Category: Chip SMD Resistors; Stock 1: 124087; Pricing 1: 1=0.10000, 10=0.02500, 100=0.01020, 1000=0.00457, 2500=0.00397 (USD); Mount: Surface Mount; Case/Package: 0603; Contact Plating: Tin,Matte; Min Operating Temperature: -55°C; Max Operating Temperature: 155°C; Packaging: Tape and Reel; Tolerance: 1%; Resistor Type: Thick Film; Number of Terminations: 2; Temperature Coefficient: 200ppm/°C; Features: Automotive AEC-Q200; Series: RMCF; Length: 0.061inch; Width: 0.031inch; Height: 0.022inch; Radiation Hardening: No; RoHS Compliant: Yes; ComponentLink1URL: https://www.seielect.com/catalog/SEI-RMCF_RMCP.pdf?src-supplier=Avnet; ComponentLink1Description: https://www.seielect.com/catalog/SEI-RMCF_RMCP.pdf?src-supplier=Avnet; ComponentLink2URL: https://www.seielect.com/Catalog/SEI-RMCF_RMCP.pdf?src-supplier=Digi-Key; ComponentLink2Description: https://www.seielect.com/Catalog/SEI-RMCF_RMCP.pdf?src-supplier=Digi-Key; ComponentLink3URL: https://www.seielect.com/catalog/SEI-Packaging.pdf?src-supplier=Digi-Key; ComponentLink3Description: https://www.seielect.com/catalog/SEI-Packaging.pdf?src-supplier=Digi-Key
R11 = RMCF0603FT2M40: Res Thick Film 0603 2.4M Ohm 1% 1/10W ±200ppm/°C Molded SMD SMD Paper T/R; Manufacturer: Stackpole Electronics; Resistance: 2.4MR; Max Power Dissipation: 100mW; Supplier 1: Digi-Key; Manufacturer Part Number: RMCF0603FT2M40; RoHS: Yes; Category: Chip SMD Resistors; Stock 1: 8694; Pricing 1: 1=0.10000, 10=0.02500, 100=0.01020, 1000=0.00457, 2500=0.00397 (USD); Mount: Surface Mount; Case/Package: 0603; Case Code (Metric): 1608; Case Code (Imperial): 0603; Contact Plating: Tin,Matte; Min Operating Temperature: -55°C; Max Operating Temperature: 155°C; Packaging: Tape and Reel; Tolerance: 1%; Resistor Type: Thick Film; Number of Terminations: 2; Package Quantity: 5000; Temperature Coefficient: 200ppm/°C; Features: Automotive AEC-Q200; Series: RMCF; Length: 0.061inch; Width: 0.031inch; Height: 0.022inch; Radiation Hardening: No; RoHS Compliant: Yes; ComponentLink1URL: https://www.seielect.com/Catalog/SEI-RMCF_RMCP.pdf?src-supplier=Digi-Key; ComponentLink1Description: https://www.seielect.com/Catalog/SEI-RMCF_RMCP.pdf?src-supplier=Digi-Key; ComponentLink2URL: https://www.seielect.com/catalog/SEI-Packaging.pdf?src-supplier=Digi-Key; ComponentLink2Description: https://www.seielect.com/catalog/SEI-Packaging.pdf?src-supplier=Digi-Key; ComponentLink3URL: https://www.seielect.com/catalog/SEI-RMCF_RMCP.pdf?src-supplier=Avnet; ComponentLink3Description: https://www.seielect.com/catalog/SEI-RMCF_RMCP.pdf?src-supplier=Avnet; ComponentLink4URL: http://www.seielect.com/Catalog/SEI-RMCF_RMCP.pdf?src-supplier=Digi-Key; ComponentLink4Description: http://www.seielect.com/Catalog/SEI-RMCF_RMCP.pdf?src-supplier=Digi-Key
R12 = RCS0603180KFKEA: RES SMD 180K OHM 1% 1/4W 0603; Manufacturer: Vishay Dale; Resistance: 180kR; Max Power Dissipation: 250mW; Temperature Coefficient: 100ppm/°C; Supplier 1: Digi-Key; Manufacturer Part Number: RCS0603180KFKEA; RoHS: Yes; Category: Chip SMD Resistors; Stock 1: 4602; Pricing 1: 1=0.15000, 10=0.13300, 100=0.05120, 1000=0.02252, 2500=0.01945 (USD); Case/Package: 0603; Min Operating Temperature: -55°C; Max Operating Temperature: 155°C; Package Quantity: 5000; Packaging: Tape and Reel; Resistor Type: Thick Film; Number of Terminations: 2; Tolerance: 1%; Features: Automotive AEC-Q200; Length: 0.061inch; Width: 0.033inch; Height: 0.02inch; RoHS Compliant: Yes; ComponentLink1URL: http://www.vishay.com/docs/20065/rcse3.pdf?src-supplier=Digi-Key; ComponentLink1Description: http://www.vishay.com/docs/20065/rcse3.pdf?src-supplier=Digi-Key
R13 = RCS0603390KFKEA: RES SMD 390K OHM 1% 1/4W 0603; Manufacturer: Vishay Dale; Resistance: 390kR; Max Power Dissipation: 250mW; Temperature Coefficient: 100ppm/°C; Supplier 1: Digi-Key; Manufacturer Part Number: RCS0603390KFKEA; RoHS: Yes; Category: Chip SMD Resistors; Stock 1: 4751; Pricing 1: 1=0.15000, 10=0.13300, 100=0.05120, 1000=0.02252, 2500=0.01945 (USD); Case/Package: 0603; Min Operating Temperature: -55°C; Max Operating Temperature: 155°C; Package Quantity: 5000; Packaging: Tape and Reel; Resistor Type: Thick Film; Number of Terminations: 2; Tolerance: 1%; Features: Automotive AEC-Q200; Length: 0.061inch; Width: 0.033inch; Height: 0.02inch; RoHS Compliant: Yes; ComponentLink1URL: http://www.vishay.com/docs/20065/rcse3.pdf?src-supplier=Digi-Key; ComponentLink1Description: http://www.vishay.com/docs/20065/rcse3.pdf?src-supplier=Digi-Key
R24 = CRCW060310K0FKEAHP: Res Thick Film 0603 10K Ohm 1% 0.33W(1/3W) ±100ppm/°C Pad SMD Automotive T/R; Manufacturer: Vishay; Resistance: 10kR; Power Rating: 250mW; Voltage Rating: 75V; Supplier 1: Digi-Key; Manufacturer Part Number: CRCW060310K0FKEAHP; RoHS: Yes; Category: Chip SMD Resistors; Stock 1: 391663; Pricing 1: 1=0.17000, 10=0.14800, 100=0.05790, 1000=0.02422, 2500=0.02220 (USD); Case/Package: 0603; Contact Plating: Tin; Weight: 7.1E-05oz; Case Code (Metric): 1608; Case Code (Imperial): 0603; Min Operating Temperature: -55°C; Max Operating Temperature: 155°C; Tolerance: 1%; Resistor Type: Thick Film; Temperature Coefficient: 100ppm/°C; Packaging: Tape and Reel; Package Quantity: 10; Number of Terminations: 2; Termination: SMD/SMT; Max Power Dissipation: 250mW; Voltage Rating (DC): 75V; Features: Automotive AEC-Q200; Series: CRCW-HP; Construction: Rectangular; Resistance Tolerance: 1%; Technology: THICK FILM; Length: 1.6mm; Width: 0.033inch; Height: 0.45mm; Depth: 0.85mm; Radiation Hardening: No; REACH SVHC: Unknown; Military Standard: Not; Lead Free: Lead Free; RoHS Compliant: Yes; ComponentLink1URL: https://datasheet.ciiva.com/9052/crcwhpe3-9052617.pdf?src-supplier=Avnet; ComponentLink1Description: https://datasheet.ciiva.com/9052/crcwhpe3-9052617.pdf?src-supplier=Avnet; ComponentLink2URL: https://datasheet.ciiva.com/2472/crcwhpe3-2472532.pdf?src-supplier=Digi-Key; ComponentLink2Description: https://datasheet.ciiva.com/2472/crcwhpe3-2472532.pdf?src-supplier=Digi-Key; ComponentLink3URL: https://datasheet.ciiva.com/2472/crcwhpe3-2472533.pdf?src-supplier=Digi-Key; ComponentLink3Description: https://datasheet.ciiva.com/2472/crcwhpe3-2472533.pdf?src-supplier=Digi-Key; ComponentLink4URL: https://datasheet.ciiva.com/2472/crcwhpe3-2472534.pdf?src-supplier=Digi-Key; ComponentLink4Description: https://datasheet.ciiva.com/2472/crcwhpe3-2472534.pdf?src-supplier=Digi-Key; ComponentLink5URL: https://datasheet.ciiva.com/5548/crcwhpe3-46056-5548143.pdf?src-supplier=Mouser; ComponentLink5Description: https://datasheet.ciiva.com/5548/crcwhpe3-46056-5548143.pdf?src-supplier=Mouser; ComponentLink6URL: https://datasheet.ciiva.com/28588/1912814-28588878.pdf?src-supplier=Element14; ComponentLink6Description: https://datasheet.ciiva.com/28588/1912814-28588878.pdf?src-supplier=Element14
SW3-SW6 = PRPC001DAAN-RC: as SW1 on sheet Battery_PMIC; Supplier 1: Digi-Key; Manufacturer Part Number: PRPC001DAAN-RC; RoHS: Yes; Category: Connectors; Stock 1: 15318; Pricing 1: 1=0.08000, 10=0.07300, 25=0.05400, 50=0.04640, 100=0.04490, 250=0.03872, 500=0.03716 (USD); Mount: Through Hole; Color: Black; Contact Plating: Gold; Package Quantity: 1; Number of Rows: 2; Packaging: Bulk; Termination: Solder; Series: -; Contact Type: Male Pin; Contact Mating Length: 0.23inch; ComponentLink1URL: https://datasheet.ciiva.com/741/xrxczzzdxxn-rc-11636-b-741284.pdf?src-supplier=Digi-Key; ComponentLink1Description: https://datasheet.ciiva.com/741/xrxczzzdxxn-rc-11636-b-741284.pdf?src-supplier=Digi-Key
TP2 TP3 = TP_10x_Probe: Test Point 300 mil centers
U2 = LTC3536EDD#TRPBF: Dp-Swreg/Monolithic 1A Low Noise, Buck-Boost Dc/Dc Converter; Manufacturer: Analog Devices / Linear Technology; Output Voltage: 5.5V; Efficiency: 95%; Min Input Voltage: 1.8V; Number of Outputs: 1; Switching Frequency: 2MHz; Synchronous Rectifier: Yes; Output Type: Adjustable; Supplier 1: Digi-Key; Manufacturer Part Number: LTC3536EDD#TRPBF; RoHS: Yes; Category: Voltage Regulators - Switching; Stock 1: 9880; Pricing 1: 1=7.42000, 10=6.70000, 25=6.38880, 100=5.54720, 250=5.29788, 500=4.85100 (USD); Case/Package: DFN; Number of Pins: 10; Min Operating Temperature: -40°C; Max Operating Temperature: 125°C; Output Current: 1A; Package Quantity: 2500; Packaging: Tape and Reel; Series: -; RoHS Compliant: Yes; ComponentLink1URL: https://datasheet.ciiva.com/2032/40104-2032093.pdf?src-supplier=Digi-Key; ComponentLink1Description: https://datasheet.ciiva.com/2032/40104-2032093.pdf?src-supplier=Digi-Key
U3 = TPS61032RSAR: 5-V Output, 1-A, 96% Efficient Boost Converter w/20uA Iq in TSSOP-16 16-QFN -40 to 85; Manufacturer: Texas Instruments; Output Voltage: 5V; Output Current: 1A; Operating Supply Voltage: 5.5V; Number of Outputs: 1; Min Input Voltage: 1.8V; Switching Frequency: 600kHz; Synchronous Rectifier: Yes; Quiescent Current: 20uA; Output Type: Fixed; Output Configuration: Positive; Supplier 1: Digi-Key; Manufacturer Part Number: TPS61032RSAR; RoHS: Yes; Category: Voltage Regulators - Switching; Pricing 1: 1=3.13000, 10=2.80800, 25=2.65440, 100=2.30060, 250=2.18260, 500=1.95844, 1000=1.94775 (USD); Mount: Surface Mount; Case/Package: VQFN; Number of Pins: 16; Weight: 0.001464oz; Min Operating Temperature: -40°C; Max Operating Temperature: 85°C; Package Quantity: 1; Series: -; Efficiency: 96%; Packaging: Tape and Reel; Max Input Voltage: 5.5V; Max Output Current: 1A; Min Output Voltage: 5V; Nominal Output Voltage: 5V; Topology: Boost; Width: 4mm; Radiation Hardening: No; REACH SVHC: No SVHC; Lead Free: Lead Free; RoHS Compliant: Yes; ComponentLink1URL: https://datasheet.ciiva.com/15113/getdatasheetpartid-188315-15113727.pdf?src-supplier=Verical; ComponentLink1Description: https://datasheet.ciiva.com/15113/getdatasheetpartid-188315-15113727.pdf?src-supplier=Verical; ComponentLink2URL: https://datasheet.ciiva.com/26896/tps61032rsar-26896598.pdf?src-supplier=IIIC; ComponentLink2Description: https://datasheet.ciiva.com/26896/tps61032rsar-26896598.pdf?src-supplier=IIIC; ComponentLink3URL: https://datasheet.ciiva.com/2026/tps61030-2026189.pdf?src-supplier=Digi-Key; ComponentLink3Description: https://datasheet.ciiva.com/2026/tps61030-2026189.pdf?src-supplier=Digi-Key; ComponentLink4URL: https://datasheet.ciiva.com/2026/tps61030-2026190.pdf?src-supplier=Digi-Key; ComponentLink4Description: https://datasheet.ciiva.com/2026/tps61030-2026190.pdf?src-supplier=Digi-Key; ComponentLink5URL: https://datasheet.ciiva.com/2026/tps61030-2026191.pdf?src-supplier=Digi-Key; ComponentLink5Description: https://datasheet.ciiva.com/2026/tps61030-2026191.pdf?src-supplier=Digi-Key; ComponentLink6URL: https://datasheet.ciiva.com/22684/1902788-22684647.pdf?src-supplier=Element14; ComponentLink6Description: https://datasheet.ciiva.com/22684/1902788-22684647.pdf?src-supplier=Element14